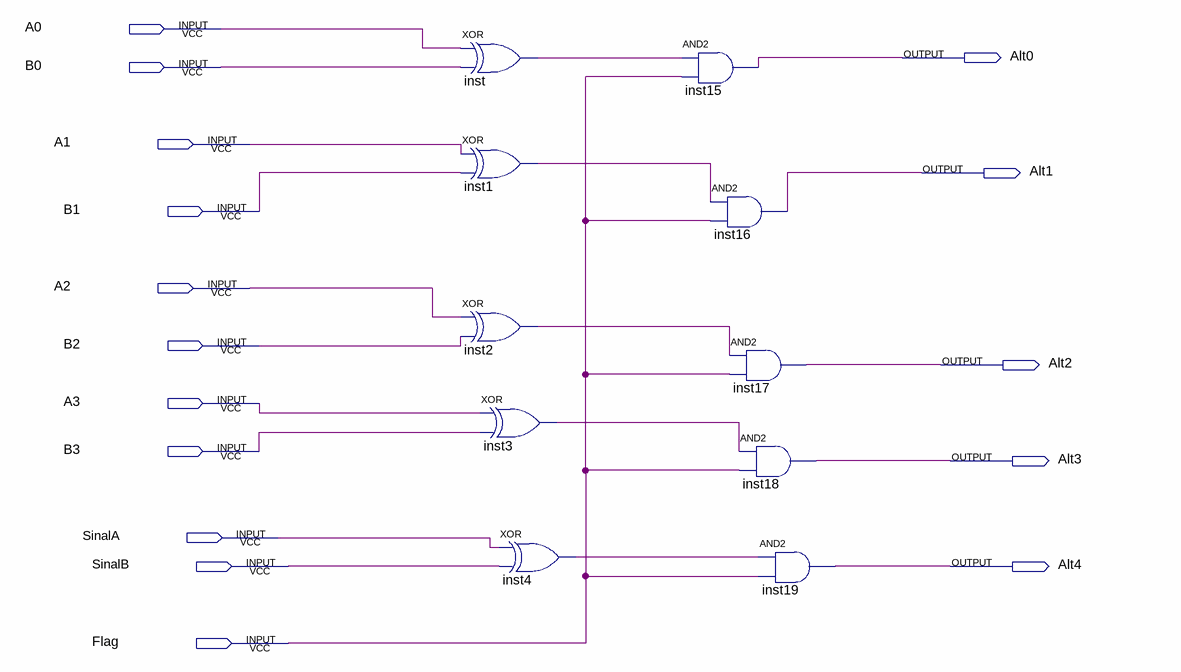
[diagram p0: schematic sheet]
// Quartus schematic XOR1.bdf as structural Verilog: 10 symbols, 16 pins
module XOR1 (
  input  A0,
  input  B0,
  input  A1,
  input  B1,
  input  A2,
  input  B2,
  input  A3,
  input  B3,
  input  SinalA,
  input  SinalB,
  input  Flag,
  output Alt0,
  output Alt1,
  output Alt2,
  output Alt3,
  output Alt4
);

  wire inst1_out, inst2_out, inst3_out, inst4_out, inst_out;

  xor inst (inst_out, A0, B0);
  xor inst1 (inst1_out, A1, B1);
  xor inst2 (inst2_out, A2, B2);
  xor inst3 (inst3_out, A3, B3);
  xor inst4 (inst4_out, SinalA, SinalB);
  and inst15 (Alt0, inst_out, Flag);
  and inst16 (Alt1, inst1_out, Flag);
  and inst17 (Alt2, inst2_out, Flag);
  and inst18 (Alt3, inst3_out, Flag);
  and inst19 (Alt4, inst4_out, Flag);
endmodule
